# EAGLE design motadora (EAGLE 6.5.0)
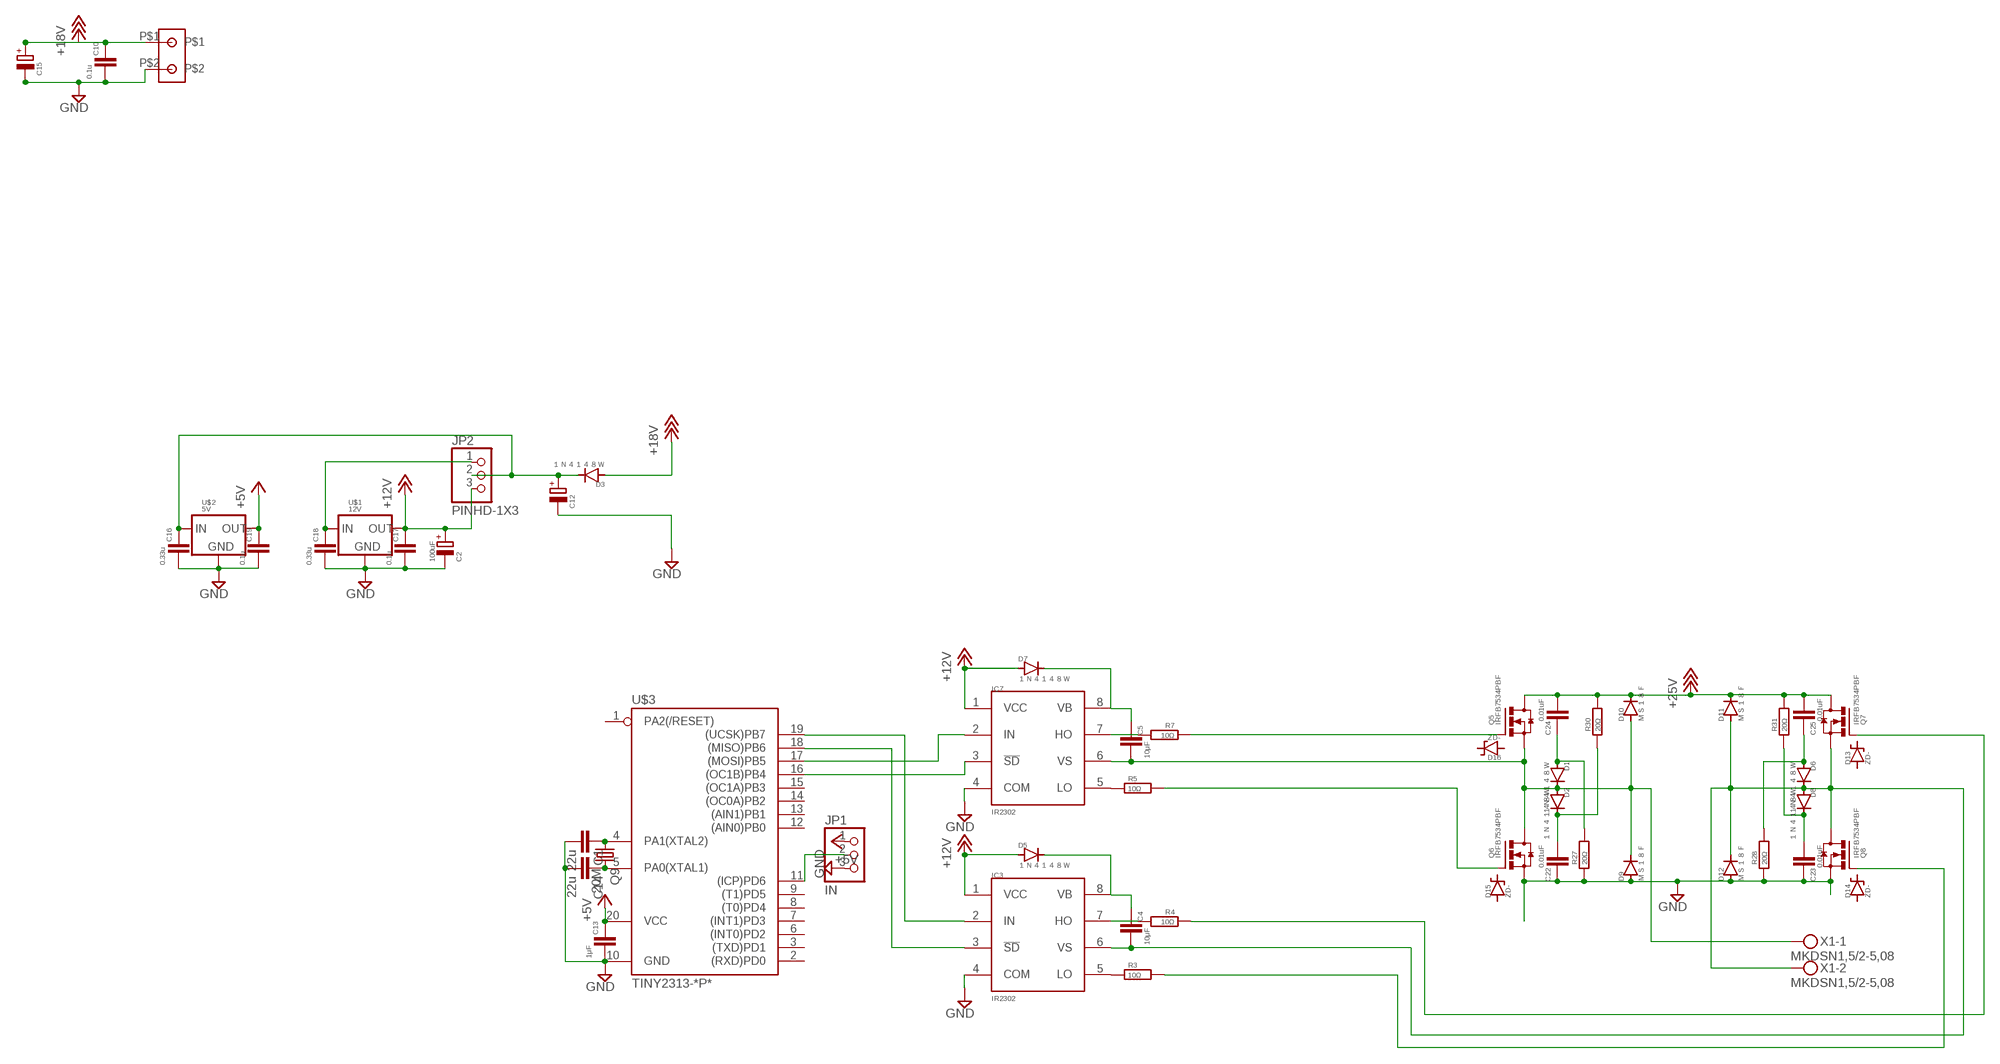
[diagram p0: schematic, sheet 1]

## Parts
C1  22u  C-EU025-024X044  [C025-024X044]
C2  100uF  CPOL-EUE2.5-7  [E2,5-7]
C4  10μF  C-EU050-024X044  [C050-024X044]
C5  10μF  C-EU050-024X044  [C050-024X044]
C10  0.1u  C-2012  [2012]
C12  CPOL-EUE2.5-7  [E2,5-7]
C13  1μF  C-EU050-024X044  [C050-024X044]
C14  22u  C-EU025-024X044  [C025-024X044]
C15  CPOL-EUE2.5-7  [E2,5-7]
C16  0.33u  C-2012  [2012]
C17  0.1u  C-2012  [2012]
C18  0.33u  C-2012  [2012]
C19  0.1u  C-2012  [2012]
C22  0.01uF  C2012  [2012]
C23  0.01uF  C-2012  [2012]
C24  0.01uF  C2012  [2012]
C25  0.01uF  C-2012  [2012]
D1  １Ｎ４１４８Ｗ  D-SOD123  [SOD123]
D2  １Ｎ４１４８Ｗ  D-SOD123  [SOD123]
D3  １Ｎ４１４８Ｗ  DIODE-D-7.5  [D-7.5]
D5  １Ｎ４１４８Ｗ  DIODE-D-7.5  [D-7.5]
D6  １Ｎ４１４８Ｗ  D-SOD123  [SOD123]
D7  １Ｎ４１４８Ｗ  DIODE-D-7.5  [D-7.5]
D8  １Ｎ４１４８Ｗ  D-SOD123  [SOD123]
D9  ＭＳ１８Ｆ  D-^MS18F  [^MS18F]
D10  ＭＳ１８Ｆ  D-^MS18F  [^MS18F]
D11  ＭＳ１８Ｆ  D-^MS18F  [^MS18F]
D12  ＭＳ１８Ｆ  D-^MS18F  [^MS18F]
D13  ZD-  [^U1ZB]
D14  ZD-  [^U1ZB]
D15  ZD-  [^U1ZB]
D16  ZD-  [^U1ZB]
IC3  IR2302  IR2302IR2302  [DIL08]
IC7  IR2302  IR2302IR2302  [DIL08]
JP1  IN  PINHD-1X3  [1X03]
JP2  PINHD-1X3  [1X03]
Q5  IRFB7534PBF  MOS-FET_N(D2PACK)  [D2PACK]
Q6  IRFB7534PBF  MOS-FET_N(D2PACK)  [D2PACK]
Q7  IRFB7534PBF  MOS-FET_N(D2PACK)  [D2PACK]
Q8  IRFB7534PBF  MOS-FET_N(D2PACK)  [D2PACK]
Q9  20M  CRYSTALHC49S  [HC49/S]
R3  10Ω  R-  [2012]
R4  10Ω  R-  [2012]
R5  10Ω  R-  [2012]
R7  10Ω  R-  [2012]
R27  20Ω  R-  [2012]
R28  20Ω  R-  [2012]
R30  20Ω  R-  [2012]
R31  20Ω  R-  [2012]
T1  TANSIDAI  [A]
U$1  12V  V-REG(SOT-89)  [SOT-89]
U$2  5V  V-REG(SOT-89)  [SOT-89]
U$3  TINY2313-*P*  [DIL20]
X1  MKDSN1,5/2-5,08  [MKDSN1,5/2-5,08]

## Nets
+5V: C13.1 C19.1 JP1.1 U$2.1(OUT) U$3.20(VCC)
+12V: C2.+ C17.1 D5.A D7.A IC3.1(VCC) IC7.1(VCC) JP2.3 U$1.1(OUT)
+18V: C10.1 C15.+ C24.2 C25.2 D3.A D10.CATHODE(C) D11.CATHODE(C) Q5.2(D) Q7.2(D) R30.2 R31.2 T1.P$1 ; supply symbol labelled +25V
GND: C1.2 C2.- C10.2 C12.- C13.2 C14.2 C15.- C16.2 C17.2 C18.2 C19.2 C22.1 C23.1 D9.ANODE(A) D12.ANODE(A) IC3.4(COM) IC7.4(COM) JP1.3 Q6.3(S) Q8.3(S) R27.1 R28.1 T1.P$2 U$1.2(GND) U$2.2(GND) U$3.10(GND)
N$1: JP1.2 U$3.11((ICP)PD6)
N$2: IC3.2(IN) U$3.19((UCSK)PB7)
N$3: IC7.2(IN) U$3.17((MOSI)PB5)
N$4: C5.2 D1.C D2.A D9.CATHODE(C) D10.ANODE(A) IC7.6(VS) Q5.3(S) Q6.2(D) X1.1
N$16: C24.1 D1.A R27.2
N$21: C22.2 D2.C R30.1
N$22: C14.1 Q9.2 U$3.5(PA0(XTAL1))
N$25: C1.1 Q9.1 U$3.4(PA1(XTAL2))
N$34: C23.2 D8.C R31.1
N$35: C25.1 D6.A R28.2
N$37: C18.1 JP2.1 U$1.3(IN)
N$38: Q8.1(G) R3.2
N$39: Q7.1(G) R4.1
N$40: IC3.5(LO) R3.1
N$41: IC3.3(!SD) U$3.18((MISO)PB6)
N$42: IC3.7(HO) R4.2
N$43: C4.1 D5.C IC3.8(VB)
N$45: C4.2 D6.C D8.A D11.ANODE(A) D12.CATHODE(C) IC3.6(VS) Q7.3(S) Q8.2(D) X1.2
N$48: Q6.1(G) R5.2
N$49: Q5.1(G) R7.1
N$50: IC7.5(LO) R5.1
N$51: IC7.3(!SD) U$3.16((OC1B)PB4)
N$52: IC7.7(HO) R7.2
N$53: C5.1 D7.C IC7.8(VB)
N$89: C12.+ C16.1 D3.C JP2.2 U$2.3(IN)
Unconnected: D13.ANODE(A) D13.CATHODE(C) D14.ANODE(A) D14.CATHODE(C) D15.ANODE(A) D15.CATHODE(C) D16.ANODE(A) D16.CATHODE(C) U$3.1(PA2(/RESET)) U$3.2((RXD)PD0) U$3.3((TXD)PD1) U$3.6((INT0)PD2) U$3.7((INT1)PD3) U$3.8((T0)PD4) U$3.9((T1)PD5) U$3.12((AIN0)PB0) U$3.13((AIN1)PB1) U$3.14((OC0A)PB2) U$3.15((OC1A)PB3)

## Library data of the parts
C1 C14 = _rcl:C-EU: CAPACITOR, European symbol
C2 C12 C15 = _Capasiter(ｺﾝﾃﾞﾝｻ):CPOL-EU: POLARIZED CAPACITOR, European symbol
C4 C5 C13 = _Capasiter(ｺﾝﾃﾞﾝｻ):C-EU: CAPACITOR, European symbol
C10 C23 C25 = _diode2:C-
C16-C19 = _00ﾁｯﾌﾟ:C-
C22 C24 = _diode2:C
D1 D2 D6 D8-D12 = _diode2:D-
D3 D5 D7 = _diode(ﾀﾞｲｵｰﾄﾞ):DIODE-: DIODE
D13-D16 = _diode2:ZD-
IC3 IC7 = _irs(ｹﾞｰﾄﾄﾞﾗｲﾊﾞIC):IR2302
JP1 JP2 = _pinhead(ﾋﾟﾝﾍｯﾀﾞ):PINHD-1X3: PIN HEADER
Q5-Q8 = _FET&transister&v-reg:MOS-FET_N
Q9 = crystal:CRYSTAL: CRYSTAL; OC_FARNELL: 1667008; OC_NEWARK: unknown
R3-R5 R7 R27 R28 R30 R31 = _00ﾁｯﾌﾟ:R-
T1 = 000tansidai:TANSIDAI: TANSIDAI 1Kyoku
U$1 U$2 = _FET&transister&v-reg:V-REG
U$3 = _avr-6:TINY2313*: Atmel Tiny2313 2K Flash, 128 bytes EEPROM, 128 bytes RAM
X1 = 0con-phoenix-508(ﾀｰﾐﾅﾙ):MKDSN1,5/2-5,08: MKDSN 1,5/ 2-5,08 Printklemme Nennstrom: 13,5 A Nennspannung: 250 V Rastermaß: 5,08 mm Polzahl: 2 Anschlussart: Schraubanschluss Montage: Löten Anschlussrichtung Leiter/Platine: 0 ° Artikelnummer: 1729128 Source: http://eshop.phoenixcontact.com .. 1729128.pdf; MPN: MKDSN 1,5/2-5.08; OC_FARNELL: 1792903; OC_NEWARK: 30M2397

## Board
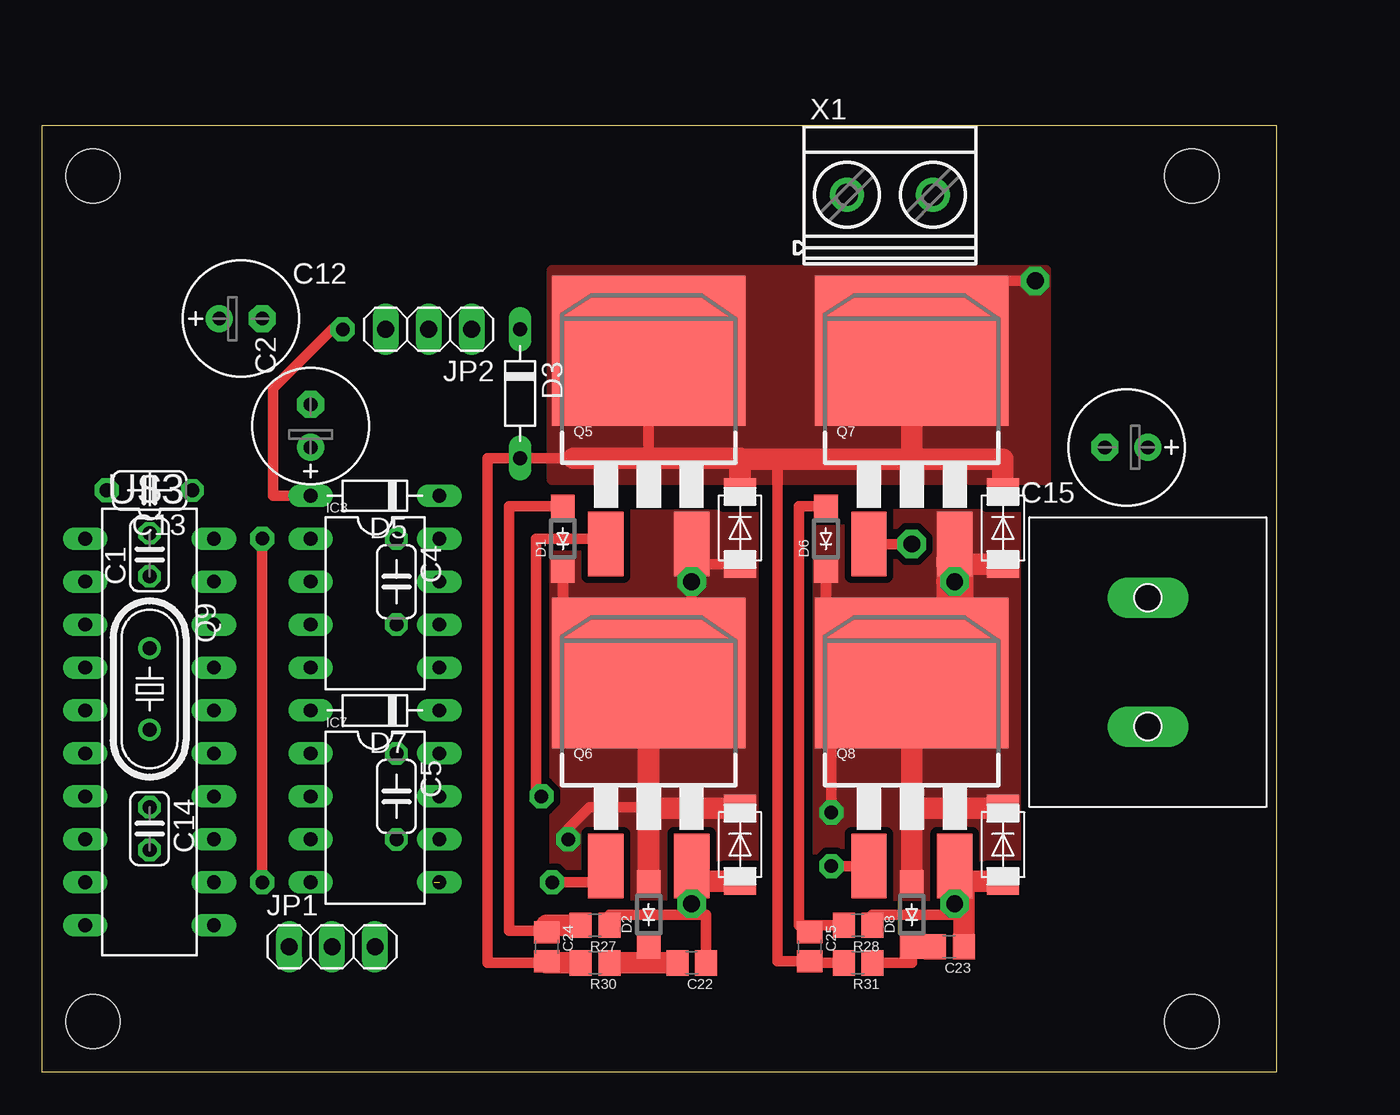
[diagram p1: board, top side]
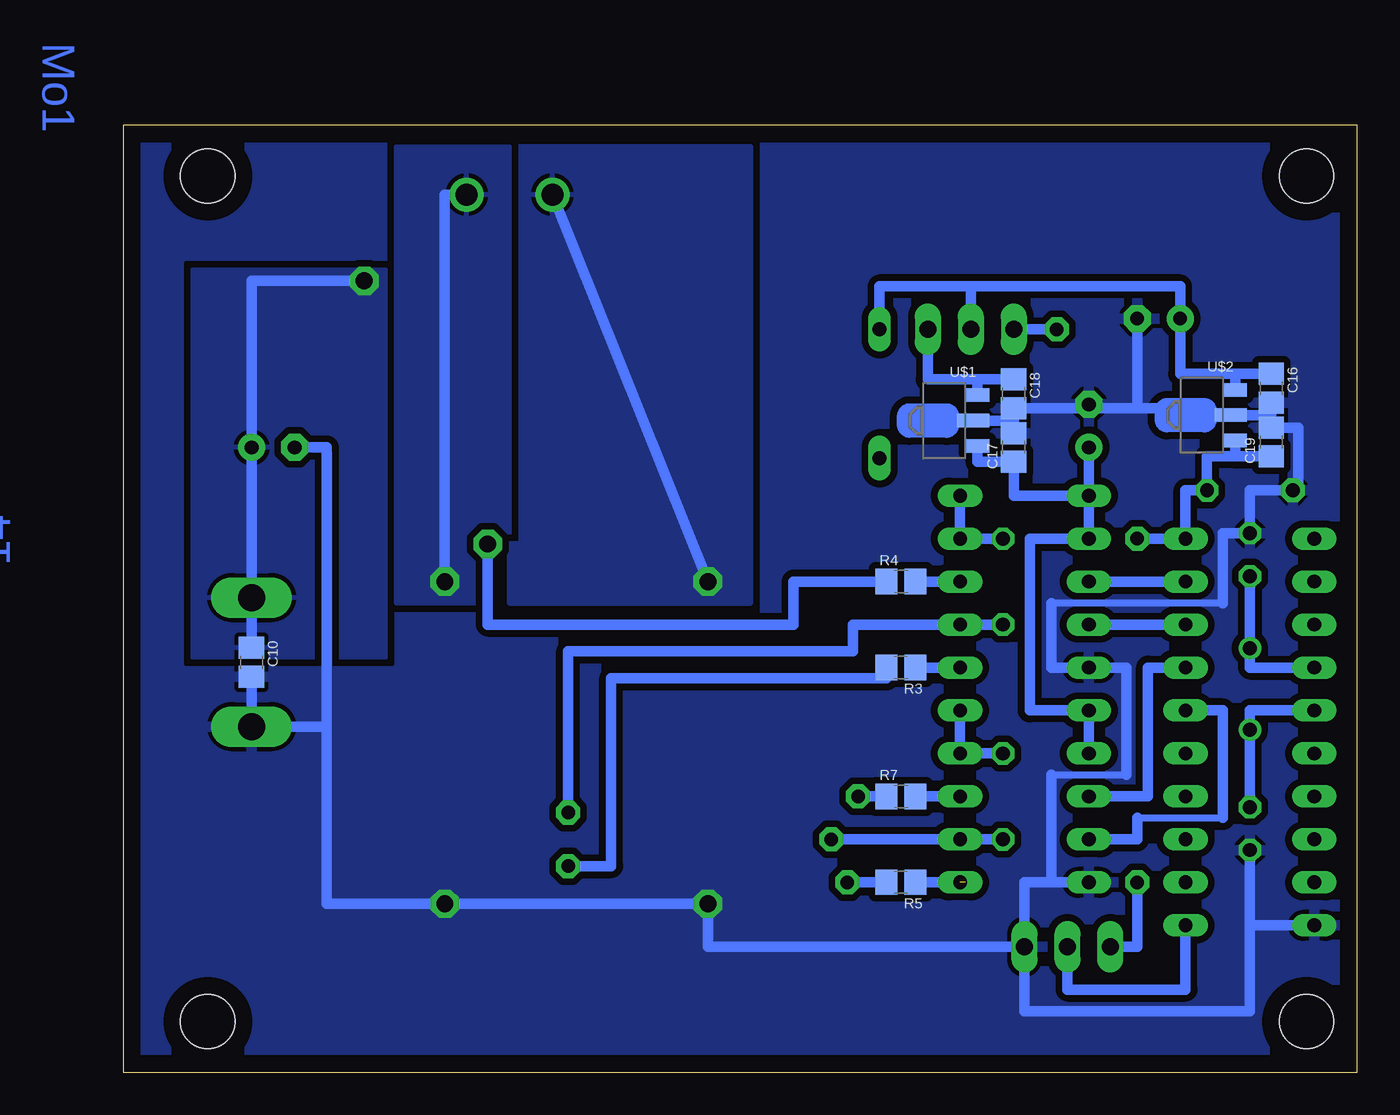
[diagram p2: board, bottom side, seen from below]

Size 73 x 56 mm. Coordinates in mm from the lower left corner, seen from the top.
Outline: 0,56 73,56 73,0 0,0 0,56
Copper layers (1*16): Top 0.035mm / dielectric 1.5mm / Bottom 0.035mm
Design rules "default *": minimum track width 10mil, minimum drill 24mil, track to track 8mil, track to pad 8mil, pad to pad 8mil, via to via 8mil, smd to smd 8mil, copper to edge 40mil, drill to drill 8mil, minimum pad ring 10mil, minimum via ring 8mil, stop-mask expansion 4mil, vias tented up to drill 0mil, thermal gap 10mil
Holes 3.2 mm at 3,53 3,3 68,3 68,53

### Footprints (pad centres in the part's own frame; a part is rotated, then mirrored left to right if it is on the bottom)
C025-024X044 = drill 0.813 octagon: 1 -1.27,0; 2 1.27,0
E2,5-7 = drill 0.813 pad 1.6: + -1.27,0 | drill 0.813 pad 1.6 octagon: - 1.27,0
C050-024X044 = drill 0.813 octagon: 1 -2.54,0; 2 2.54,0
2012 = smd 1.3 x 1.5: 1 -0.85,0; 2 0.85,0
SOD123 = smd 1.4 x 1.4: A 1.905,0; C -1.905,0
D-7.5 = drill 0.813 long: A 3.81,0; C -3.81,0
^MS18F = smd 1.6 x 1.905: ANODE 2.146,0; CATHODE -2.146,0
^U1ZB = smd 2 x 2: ANODE 2.1,0; CATHODE -2.1,0
DIL08 = drill 0.813 long: 1 -3.81,-3.81; 2 -1.27,-3.81; 3 1.27,-3.81; 4 3.81,-3.81; 5 3.81,3.81; 6 1.27,3.81; 7 -1.27,3.81; 8 -3.81,3.81
1X03 = drill 1.016 long: 1 -2.54,0; 2 0,0; 3 2.54,0
D2PACK = smd 2.083 x 3.81: 1 -2.54,-9.525; 3 2.54,-9.525 | smd 11.43 x 8.89: 2 0,1.905
HC49/S = drill 0.813: 1 -2.413,0; 2 2.413,0
A = drill 1.6 long: P$1 3.81,0; P$2 -3.81,0
SOT-89 = smd 0.8 x 1.4: 1 -1.499,-2.616; 3 1.499,-2.616 | smd 0.8 x 1.9: 2 0,-2.362
DIL20 = drill 0.813 long: 1 -11.43,-3.81; 2 -8.89,-3.81; 3 -6.35,-3.81; 4 -3.81,-3.81; 5 -1.27,-3.81; 6 1.27,-3.81; 7 3.81,-3.81; 8 6.35,-3.81; 9 8.89,-3.81; 10 11.43,-3.81; 11 11.43,3.81; 12 8.89,3.81; 13 6.35,3.81; 14 3.81,3.81; 15 1.27,3.81; 16 -1.27,3.81; 17 -3.81,3.81; 18 -6.35,3.81; 19 -8.89,3.81; 20 -11.43,3.81
MKDSN1,5/2-5,08 = drill 1.3 pad 2: 1 -2.561,0.025; 2 2.519,0.025

### Placement (x,y rotation side)
C1  6.35,30.6 90 top
C2  15.88,38.22 90 top
C4  20.95,29.01 270 top
C5  20.95,16.31 270 top
C10  65.41,24.25 270 bottom
C12  11.75,44.57 0 top
C13  6.35,34.41 180 top
C14  6.35,14.41 270 top
C15  64.14,36.95 180 top
C16  5.08,40.44 270 bottom
C17  20.32,36.95 90 bottom
C18  20.32,40.12 270 bottom
C19  5.08,37.27 90 bottom
C22  38.42,6.47 180 top
C23  53.66,7.42 180 top
C24  29.84,7.42 270 top
C25  45.4,7.42 270 top
D1  30.8,31.55 90 top
D2  35.88,9.33 90 top
D3  28.26,40.12 270 top
D5  19.68,34.09 180 top
D6  46.35,31.55 90 top
D7  19.68,21.39 180 top
D8  51.44,9.33 90 top
D9  41.27,13.46 270 top
D10  41.27,32.19 270 top
D11  56.83,32.19 270 top
D12  56.83,13.46 270 top
D13  -7.94,8.69 0 top  (outside the outline)
D14  -7.94,6.15 0 top  (outside the outline)
D15  -7.94,3.61 0 top  (outside the outline)
D16  -7.94,1.07 0 top  (outside the outline)
IC3  19.68,27.74 270 top
IC7  19.68,15.04 270 top
JP1  17.14,7.42 0 top
JP2  22.86,43.93 180 top
Q5  35.88,40.76 0 top
Q6  35.88,21.71 0 top
Q7  51.44,40.76 0 top
Q8  51.44,21.71 0 top
Q9  6.35,22.66 270 top
R3  26.99,23.93 180 bottom
R4  26.99,29.01 0 bottom
R5  26.99,11.23 180 bottom
R7  26.99,16.31 0 bottom
R27  32.7,8.69 180 top
R28  48.26,8.69 180 top
R30  32.7,6.47 180 top
R31  48.26,6.47 180 top
T1  65.41,24.25 90 top
U$1  25.08,38.54 90 bottom
U$2  9.84,38.85 90 bottom
U$3  6.35,20.12 270 top
X1  50.16,51.87 0 top

### Tracks (layer width: path | path; a pad name or v marks a point on that pad's centre or on a via)
+5V  (via drill 0.8 pad 1.42)
  Top 0.61: v13.02,11.23 v13.02,31.55
  Bottom 0.61: U$2.1 7.23,36.42 C19.1 8.89,36.42 C13.1 10.16,34.41 U$3.20 v13.02,31.55 | JP1.1 13.02,7.42 v13.02,11.23
+12V  (via drill 0.8 pad 1.42)
  Top 0.61: D5.A 13.65,34.09 13.65,40.44 17.14,43.93 v17.78,43.93
  Bottom 0.61: IC7.1 D7.A 19.37,21.39 19.37,31.55 IC3.1 D5.A | U$1.1 22.47,36.1 C17.1 20.32,34.09 D5.A | C2.+ D5.A | JP2.3 v17.78,43.93
+18V  (via drill 1 pad 1.68)
  Top 0.61: R31.2 45.4,6.47 C25.2 43.5,6.57 43.5,36.24 | R30.2 26.35,6.47 26.35,36.31 D3.A 32.07,36.31 35.88,36.31 Q5.2 | v58.74,46.79 51.44,46.79 51.44,42.03
  Top 1.27: 51.44,36.24 51.44,42.03 Q7.2 | 51.44,36.24 43.5,36.24 41.27,36.24 D10.CATHODE 41.27,36.31 32.07,36.31 31.43,36.31 | D11.CATHODE 56.83,36.24 51.44,36.24 | R30.2 29.84,6.47 C24.2
  Bottom 0.61: v58.74,46.79 65.41,46.79 C15.+ T1.P$1 C10.1
  pour Top (isolate 0.406, no thermals): 59.37,47.43 59.37,35.04 30.16,35.04 30.16,47.43
  pour Bottom (isolate 0.406): 57.47,47.43 68.9,47.43 68.9,24.57 57.47,24.57
GND  (via drill 0.8 pad 1.42, 1 pad 1.68)
  Top 0.61: R28.1 49.11,9.33 53.98,9.33 v53.98,9.96 53.98,11.31 D12.ANODE | 38.42,9.33 33.55,9.33 R27.1 | v38.42,9.96 38.42,9.33 | 38.42,9.33 39.27,9.33 C22.1
  Top 1.27: Q8.3 53.98,11.31 54.51,11.31 | 54.51,11.31 D12.ANODE | C23.1 54.51,11.31 | Q6.3 38.42,11.31 | 38.42,11.31 v38.42,9.96 | D9.ANODE 38.42,11.31
  Bottom 0.406: 18.1,17.58 13.65,17.58 | 7.94,27.74 18.1,27.74
  Bottom 0.61: IC7.4 18.1,11.23 | 18.1,11.23 18.1,17.58 | 13.65,17.58 13.65,23.93 IC3.4 18.1,23.93 18.1,27.74 | U$1.2 20.32,38.54 | 20.32,38.54 C18.2 15.88,39.27 | 20.32,38.54 C17.2 | 5.08,38.85 U$2.2 11.43,38.85 11.43,39.27 13.02,39.27 | 5.08,38.85 C19.2 3.49,38.12 3.49,34.41 C13.2 6.35,34.41 C1.2 7.94,31.87 7.94,27.74 | C16.2 5.08,38.85 | C14.2 6.35,8.69 | C2.- 15.88,39.27 | 15.88,39.27 13.02,39.27 | C12.- 13.02,39.27 | JP1.3 19.68,11.23 18.1,11.23 | JP1.3 19.68,3.61 6.35,3.61 6.35,8.69 | JP1.3 38.42,7.42 v38.42,9.96 v53.98,9.96 60.96,9.96 60.96,20.44 | 60.96,20.44 T1.P$2 C10.2 | C15.- 60.96,36.95 60.96,20.44 | U$3.10 6.35,8.69
  other vias: 3.81,34.41
  pour Bottom (isolate 0.406, rank 6): -23.5,63.3 87.31,62.67 87.63,-10.04 -23.18,-9.41
N$1
  Bottom 0.61: JP1.2 17.14,4.88 10.16,4.88 U$3.11
N$2
  Bottom 0.61: IC3.2 U$3.19
N$3
  Bottom 0.61: IC7.2 12.38,16.31 12.38,23.93 U$3.17
N$4  (via drill 0.8 pad 1.42, 1 pad 1.68)
  Top 0.61: D1.C 30.8,23.62 | 30.8,23.62 Q6.2 38.42,23.62 v38.42,29.01 Q5.3 38.42,30.04 D10.ANODE | 30.8,23.62 30.8,20.44 31.11,20.44 | v31.11,13.77 31.11,14.41 32.38,15.68 35.8,15.68 35.88,15.6
  Top 1.27: D2.A 35.88,15.6 | 35.88,15.6 Q6.2 | D9.CATHODE 35.88,15.6
  Bottom 0.61: v31.11,13.77 IC7.6 C5.2 | X1.1 v38.42,29.01
  pour Top (isolate 0.406, no thermals): 42.23,33.14 42.23,10.28 30.16,10.28 30.16,33.14
  pour Bottom (isolate 0.406, rank 2): 50.16,54.73 50.16,27.74 35.88,27.74 35.88,54.73
N$16
  Top 0.61: D1.A 27.62,33.46 27.62,8.38 29.84,8.38 C24.1
  Top 1.27: R27.2 29.84,8.69 C24.1
N$21
  Top 0.61: C22.2 35.88,6.47 D2.C
  Top 1.27: R30.1 C22.2
N$22
  Bottom 0.61: U$3.5 6.35,21.39 Q9.2 C14.1
N$25
  Bottom 0.61: U$3.4 6.35,23.93 Q9.1 C1.1
N$34
  Top 0.61: C23.2 52.07,7.42 | R31.1 51.44,6.47 D8.C
  Top 1.27: D8.C 52.07,7.42
N$35
  Top 0.61: C25.1 45.4,8.69 R28.2 44.77,8.69 44.77,33.46 D6.A
N$37
  Bottom 0.61: U$1.3 22.47,40.97 | 22.47,40.97 C18.1 | JP2.1 25.4,40.97 22.47,40.97
N$38  (via drill 0.8 pad 1.42)
  Top 0.61: Q8.1 v46.67,12.18
  Bottom 0.61: v46.67,12.18 44.13,12.18 44.13,23.3 27.84,23.3 R3.2
N$39  (via drill 1 pad 1.68)
  Top 0.61: Q7.1 v51.44,31.23
  Bottom 0.61: v51.44,31.23 51.44,26.47 33.34,26.47 33.34,29.01 R4.1
N$40
  Bottom 0.61: R3.1 IC3.5
N$41
  Bottom 0.61: IC3.3 U$3.18
N$42
  Bottom 0.61: R4.2 IC3.7
N$43
  Bottom 0.61: D5.C IC3.8 C4.1
N$45  (via drill 0.8 pad 1.42, 1 pad 1.68)
  Top 0.61: Q8.2 46.35,23.62 D6.C 46.35,20.76 46.67,20.76 v46.67,15.36 | Q7.3 v53.98,29.01
  Top 1.27: 53.98,23.62 Q8.2 51.44,15.6 | D11.ANODE 53.98,30.04 Q7.3 53.98,30.28 | D8.A 51.44,15.6 | D12.CATHODE 51.44,15.6
  Top 2.184: 53.98,30.28 53.98,30.04 v53.98,29.01 53.98,23.62
  Bottom 0.61: v53.98,29.01 53.98,51.9 X1.2 | v46.67,15.36 46.67,24.89 29.84,24.89 29.84,26.47 IC3.6 C4.2
  pour Top (isolate 0.406, no thermals): 57.78,10.28 57.78,33.14 45.72,33.14 45.72,10.28
  pour Bottom (isolate 0.406): 50.16,54.73 50.16,27.74 56.83,27.74 56.83,54.73
N$48  (via drill 0.8 pad 1.42)
  Top 0.61: Q6.1 33.34,11.23 v30.16,11.23
  Bottom 0.61: v30.16,11.23 R5.2
N$49  (via drill 0.8 pad 1.42)
  Top 0.61: Q5.1 33.34,31.55 29.21,31.55 29.21,16.31 v29.53,16.31
  Bottom 0.61: v29.53,16.31 R7.1
N$50  (1 unrouted)
  Bottom 0.61: R5.1 23.18,11.23 23.18,10.91
N$51
  Bottom 0.406: 13.02,15.04 7.94,15.04
  Bottom 0.61: IC7.3 13.02,13.77 13.02,15.04 | 7.94,15.04 7.94,21.39 U$3.16
N$52
  Bottom 0.61: IC7.7 R7.2
N$53
  Bottom 0.61: D7.C IC7.8 C5.1
N$89
  Bottom 0.61: U$2.3 7.23,41.29 | 7.23,41.29 C16.1 | 22.86,46.47 10.48,46.47 C12.+ 10.48,41.29 7.23,41.29 | 22.86,46.47 28.26,46.47 D3.C | JP2.2 22.86,46.47

### Text on the board
Bottom: Mo1 | Mo2 | 14 | < | + | -